# EAGLE design board (EAGLE 8.4.1)
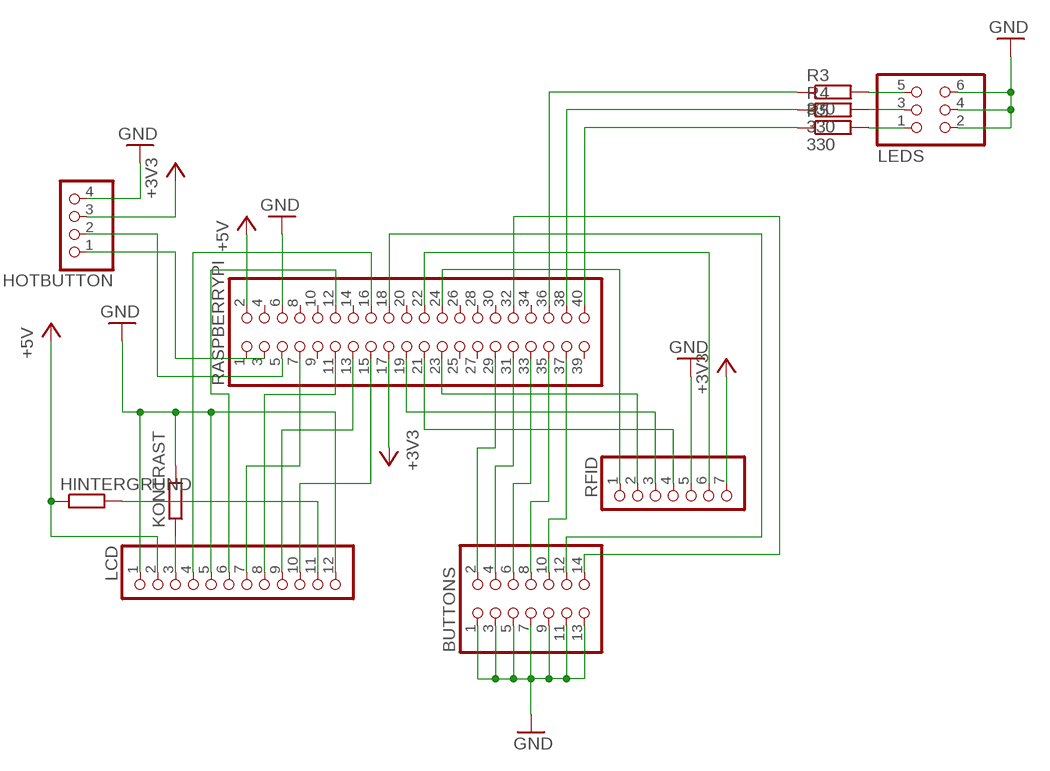
[diagram p0: schematic, sheet 1]

## Parts
BUTTONS  PINHD-2X7  [2X07]
HINTERGRUND  R-EU_0207/10  [0207/10]
HOTBUTTON  PINHD-1X4  [1X04]
KONTRAST  R-EU_0207/10  [0207/10]
LCD  PINHD-1X12  [1X12]
LEDS  PINHD-2X3  [2X03]
R3  330  R-EU_0207/10  [0207/10]
R4  330  R-EU_0207/10  [0207/10]
R5  330  R-EU_0207/10  [0207/10]
RASPBERRYPI  PINHD-2X20  [2X20]
RFID  PINHD-1X7  [1X07]

## Nets
+3V3: HOTBUTTON.3 RASPBERRYPI.17 RFID.7
+5V: HINTERGRUND.1 LCD.2 RASPBERRYPI.2
GND: BUTTONS.1 BUTTONS.3 BUTTONS.5 BUTTONS.7 BUTTONS.9 BUTTONS.11 BUTTONS.13 HOTBUTTON.4 KONTRAST.2 LCD.1 LCD.5 LCD.12 LEDS.2 LEDS.4 LEDS.6 RASPBERRYPI.6 RFID.5
N$1: RASPBERRYPI.22 RFID.6
N$2: RASPBERRYPI.24 RFID.1
N$3: RASPBERRYPI.23 RFID.2
N$4: RASPBERRYPI.19 RFID.3
N$5: RASPBERRYPI.21 RFID.4
N$6: KONTRAST.1 LCD.3
N$7: HINTERGRUND.2 LCD.11
N$8: BUTTONS.2 RASPBERRYPI.29
N$9: BUTTONS.4 RASPBERRYPI.31
N$10: BUTTONS.6 RASPBERRYPI.33
N$11: LCD.4 RASPBERRYPI.16
N$12: LCD.6 RASPBERRYPI.12
N$13: LCD.7 RASPBERRYPI.7
N$14: LCD.8 RASPBERRYPI.11
N$15: LCD.9 RASPBERRYPI.13
N$16: LCD.10 RASPBERRYPI.15
N$17: BUTTONS.8 RASPBERRYPI.35
N$18: BUTTONS.10 RASPBERRYPI.37
N$19: BUTTONS.12 RASPBERRYPI.18
N$20: BUTTONS.14 RASPBERRYPI.32
N$21: LEDS.5 R3.2
N$22: LEDS.3 R4.2
N$23: LEDS.1 R5.2
N$24: R5.1 RASPBERRYPI.40
N$25: R4.1 RASPBERRYPI.38
N$26: R3.1 RASPBERRYPI.36
N$27: HOTBUTTON.1 RASPBERRYPI.3
N$28: HOTBUTTON.2 RASPBERRYPI.5
Unconnected: RASPBERRYPI.1 RASPBERRYPI.4 RASPBERRYPI.8 RASPBERRYPI.9 RASPBERRYPI.10 RASPBERRYPI.14 RASPBERRYPI.20 RASPBERRYPI.25 RASPBERRYPI.26 RASPBERRYPI.27 RASPBERRYPI.28 RASPBERRYPI.30 RASPBERRYPI.34 RASPBERRYPI.39

## Library data of the parts
BUTTONS = pinhead:PINHD-2X7: PIN HEADER
HINTERGRUND KONTRAST R3-R5 = rcl:R-EU_: RESISTOR, European symbol
HOTBUTTON = pinhead:PINHD-1X4: PIN HEADER
LCD = pinhead:PINHD-1X12: PIN HEADER
LEDS = pinhead:PINHD-2X3: PIN HEADER
RASPBERRYPI = pinhead:PINHD-2X20: PIN HEADER
RFID = pinhead:PINHD-1X7: PIN HEADER

## Net classes
0 default: width 0.254 mm

## Board
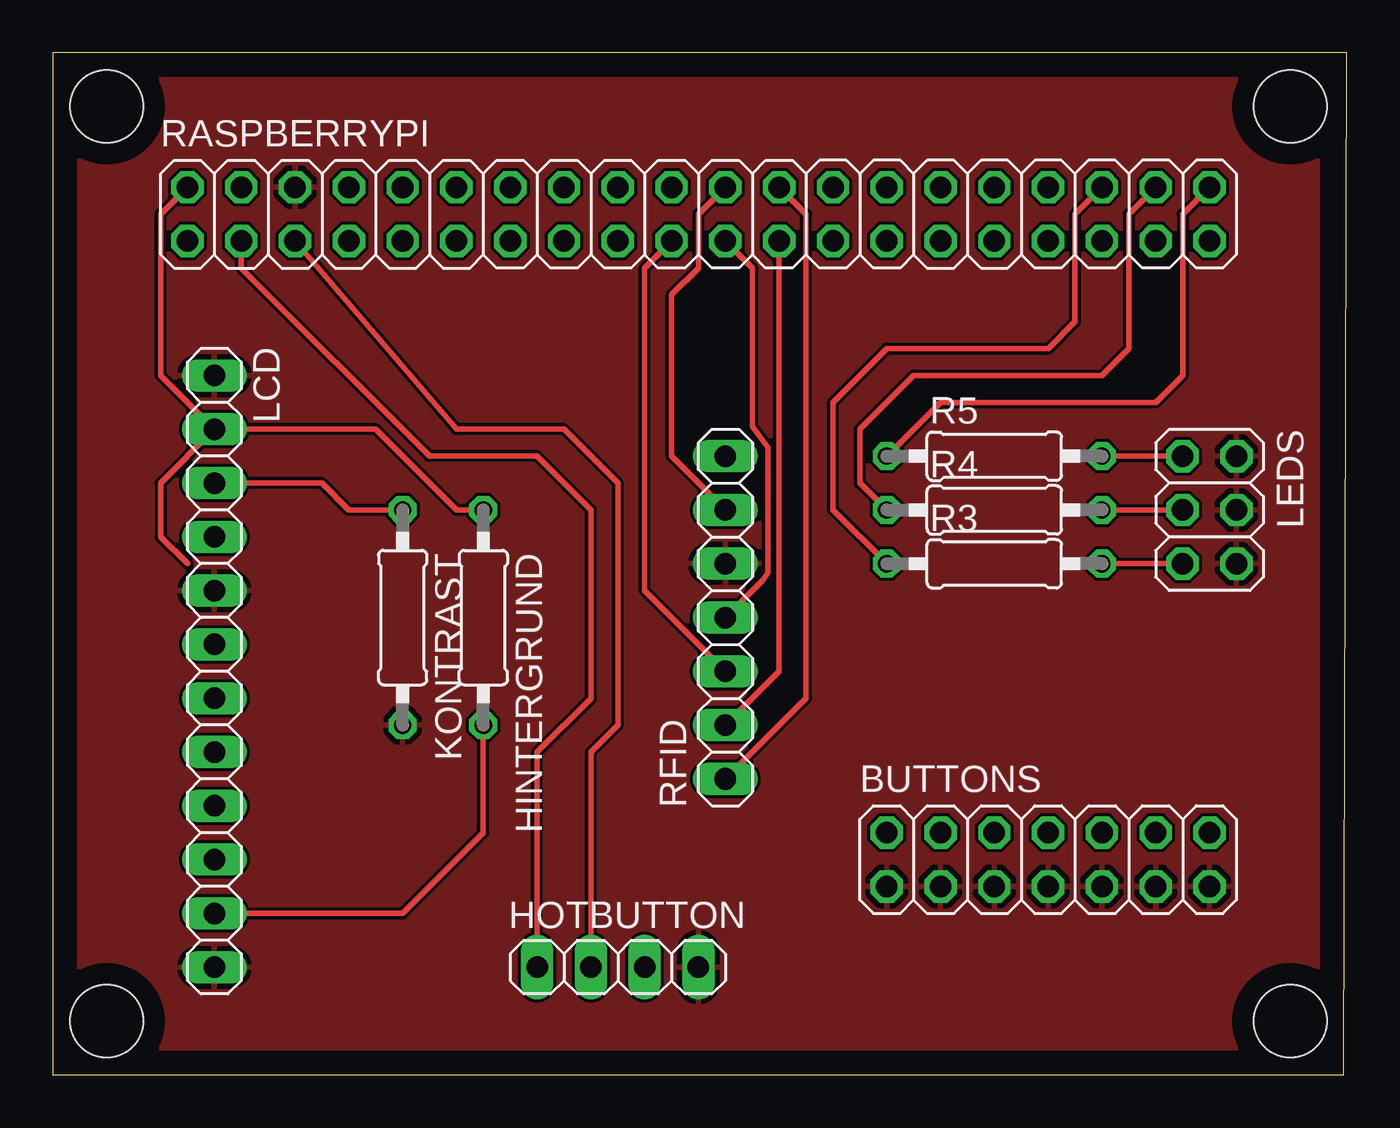
[diagram p1: board, top side]
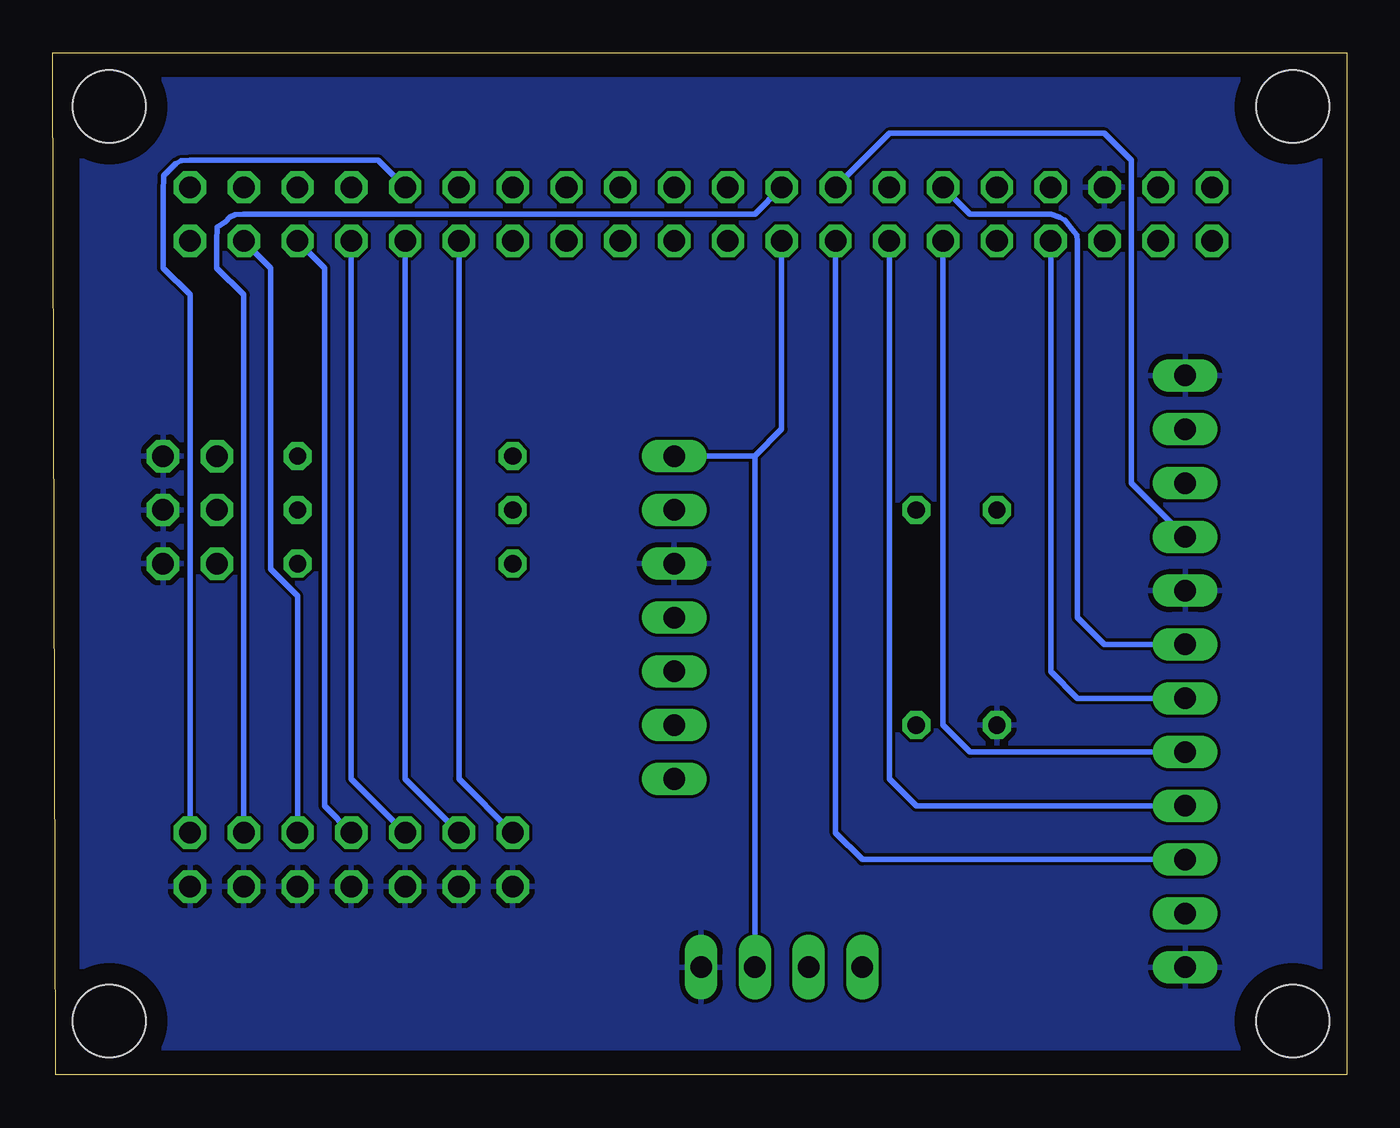
[diagram p2: board, bottom side, seen from below]

Size 61.08 x 48.25 mm. Coordinates in mm from the lower left corner, seen from the top.
Outline: 0,0 60.96,0 61.08,48.25 0,48.25 0,0
Copper layers (1*16): Top 0.035mm / dielectric 1.5mm / Bottom 0.035mm
Design rules "default": minimum track width 6mil, minimum drill 0.35mm, track to track 6mil, track to pad 6mil, pad to pad 6mil, via to via 6mil, smd to smd 6mil, copper to edge 40mil, drill to drill 6mil, minimum pad ring 10mil, minimum via ring 8mil, stop-mask expansion 4mil, vias tented up to drill 0mil, thermal gap 10mil
Holes 3.43 mm at 2.54,45.72 58.42,45.72 2.54,2.54 58.42,2.54

### Footprints (pad centres in the part's own frame; a part is rotated, then mirrored left to right if it is on the bottom)
2X07 = drill 1.016 octagon: 1 -7.62,-1.27; 2 -7.62,1.27; 3 -5.08,-1.27; 4 -5.08,1.27; 5 -2.54,-1.27; 6 -2.54,1.27; 7 0,-1.27; 8 0,1.27; 9 2.54,-1.27; 10 2.54,1.27; 11 5.08,-1.27; 12 5.08,1.27; 13 7.62,-1.27; 14 7.62,1.27
0207/10 = drill 0.813 octagon: 1 -5.08,0; 2 5.08,0
1X04 = drill 1.016 long: 1 -3.81,0; 2 -1.27,0; 3 1.27,0; 4 3.81,0
1X12 = drill 1.016 long: 1 -13.97,0; 2 -11.43,0; 3 -8.89,0; 4 -6.35,0; 5 -3.81,0; 6 -1.27,0; 7 1.27,0; 8 3.81,0; 9 6.35,0; 10 8.89,0; 11 11.43,0; 12 13.97,0
2X03 = drill 1.016 octagon: 1 -2.54,-1.27; 2 -2.54,1.27; 3 0,-1.27; 4 0,1.27; 5 2.54,-1.27; 6 2.54,1.27
2X20 = drill 1.016 octagon: 1 -24.13,-1.27; 2 -24.13,1.27; 3 -21.59,-1.27; 4 -21.59,1.27; 5 -19.05,-1.27; 6 -19.05,1.27; 7 -16.51,-1.27; 8 -16.51,1.27; 9 -13.97,-1.27; 10 -13.97,1.27; 11 -11.43,-1.27; 12 -11.43,1.27; 13 -8.89,-1.27; 14 -8.89,1.27; 15 -6.35,-1.27; 16 -6.35,1.27; 17 -3.81,-1.27; 18 -3.81,1.27; 19 -1.27,-1.27; 20 -1.27,1.27; 21 1.27,-1.27; 22 1.27,1.27; 23 3.81,-1.27; 24 3.81,1.27; 25 6.35,-1.27; 26 6.35,1.27; 27 8.89,-1.27; 28 8.89,1.27; 29 11.43,-1.27; 30 11.43,1.27; 31 13.97,-1.27; 32 13.97,1.27; 33 16.51,-1.27; 34 16.51,1.27; 35 19.05,-1.27; 36 19.05,1.27; 37 21.59,-1.27; 38 21.59,1.27; 39 24.13,-1.27; 40 24.13,1.27
1X07 = drill 1.016 long: 1 -7.62,0; 2 -5.08,0; 3 -2.54,0; 4 0,0; 5 2.54,0; 6 5.08,0; 7 7.62,0

### Placement (x,y rotation side)
BUTTONS  46.99,10.16 0 top
HINTERGRUND  20.32,21.59 270 top
HOTBUTTON  26.67,5.08 0 top
KONTRAST  16.51,21.59 270 top
LCD  7.62,19.05 270 top
LEDS  54.61,26.67 270 top
R3  44.45,24.13 0 top
R4  44.45,26.67 0 top
R5  44.45,29.21 0 top
RASPBERRYPI  30.48,40.64 0 top
RFID  31.75,21.59 90 top

### Tracks (layer width: path | path; a pad name or v marks a point on that pad's centre or on a via)
+3V3
  Bottom 0.254: 27.94,29.21 RFID.7 | 27.94,29.21 26.67,30.48 RASPBERRYPI.17 | HOTBUTTON.3 27.94,29.21
+5V
  Top 0.254: LCD.2 5.08,33.02 5.08,40.64 RASPBERRYPI.2 | LCD.2 5.08,27.94 5.08,25.4 6.35,24.13 | HINTERGRUND.1 19.05,26.67 15.24,30.48 LCD.2
GND
  pour Top: 1.27,46.99 59.69,46.99 59.69,1.27 1.27,1.27
  pour Bottom: 1.27,1.27 59.69,1.27 59.69,46.99 1.27,46.99
N$1
  Top 0.254: RFID.6 29.21,29.21 29.21,36.83 30.48,38.1 30.48,40.64 RASPBERRYPI.22
N$2
  Top 0.254: RFID.1 35.56,17.78 35.56,40.64 RASPBERRYPI.24
N$3
  Top 0.254: RFID.2 34.29,19.05 RASPBERRYPI.23
N$4
  Top 0.254: RFID.3 27.94,22.86 27.94,38.1 RASPBERRYPI.19
N$5
  Top 0.254: RFID.4 33.02,22.86 33.53,23.36 33.76,23.72 33.76,29.62 33.02,30.61 33.02,38.1 RASPBERRYPI.21
N$6
  Top 0.254: KONTRAST.1 13.97,26.67 12.7,27.94 LCD.3
N$7
  Top 0.254: HINTERGRUND.2 20.32,11.43 16.51,7.62 LCD.11
N$8
  Bottom 0.254: BUTTONS.2 41.91,13.97 RASPBERRYPI.29
N$9
  Bottom 0.254: BUTTONS.4 44.45,13.97 RASPBERRYPI.31
N$10
  Bottom 0.254: RASPBERRYPI.33 46.99,13.97 BUTTONS.6
N$11
  Bottom 0.254: LCD.4 10.16,27.94 10.16,43.18 11.43,44.45 21.59,44.45 RASPBERRYPI.16
N$12
  Bottom 0.254: RASPBERRYPI.12 17.78,40.64 13.97,40.64 13.56,40.49 13.31,40.36 12.85,39.78 12.72,39.65 12.7,39.37 12.7,21.59 11.43,20.32 LCD.6
N$13
  Bottom 0.254: LCD.7 12.7,17.78 13.97,19.05 RASPBERRYPI.7
N$14
  Bottom 0.254: LCD.8 17.78,15.24 19.05,16.51 RASPBERRYPI.11
N$15
  Bottom 0.254: LCD.9 20.32,12.7 21.59,13.97 RASPBERRYPI.13
N$16
  Bottom 0.254: LCD.10 22.86,10.16 24.13,11.43 RASPBERRYPI.15
N$17
  Bottom 0.254: BUTTONS.8 48.26,12.7 48.26,38.1 RASPBERRYPI.35
N$18
  Bottom 0.254: BUTTONS.10 49.53,22.61 50.8,23.88 50.8,38.1 RASPBERRYPI.37
N$19
  Bottom 0.254: BUTTONS.12 52.07,36.83 53.34,38.1 53.34,39.37 53.32,40.03 52.93,40.29 52.73,40.49 52.48,40.62 52.07,40.64 27.94,40.64 RASPBERRYPI.18
N$20
  Bottom 0.254: BUTTONS.14 54.61,36.83 55.88,38.1 55.88,41.91 55.86,42.19 55.86,42.45 55.27,43.03 55.02,43.15 54.61,43.18 45.72,43.18 RASPBERRYPI.32
N$21
  Top 0.254: R3.2 LEDS.5
N$22
  Top 0.254: R4.2 LEDS.3
N$23
  Top 0.254: R5.2 LEDS.1
N$24
  Top 0.254: RASPBERRYPI.40 53.34,40.64 53.34,33.02 52.07,31.75 41.91,31.75 R5.1
N$25
  Top 0.254: RASPBERRYPI.38 50.8,40.64 50.8,34.29 49.53,33.02 40.64,33.02 38.1,30.48 38.1,27.94 R4.1
N$26
  Top 0.254: RASPBERRYPI.36 48.26,40.64 48.26,35.56 46.99,34.29 39.37,34.29 36.83,31.75 36.83,26.67 R3.1
N$27
  Top 0.254: HOTBUTTON.1 22.86,15.24 25.4,17.78 25.4,26.67 22.86,29.21 17.78,29.21 8.89,38.1 RASPBERRYPI.3
N$28
  Top 0.254: HOTBUTTON.2 25.4,15.24 26.67,16.51 26.67,27.94 24.13,30.48 19.05,30.48 RASPBERRYPI.5